# Altium project lorawan_gateway.PrjPcb (part 2 of 2)

## Sheet Power.SchDoc: Power banks
size A4; Author: Lucas Liaño; Revision: 1; SheetNumber: 7; SheetTotal: 8
Used 2 times, as channels Principal/Power, Redundado/Power. Parts and nets are listed once, with the designators drawn on the sheet.
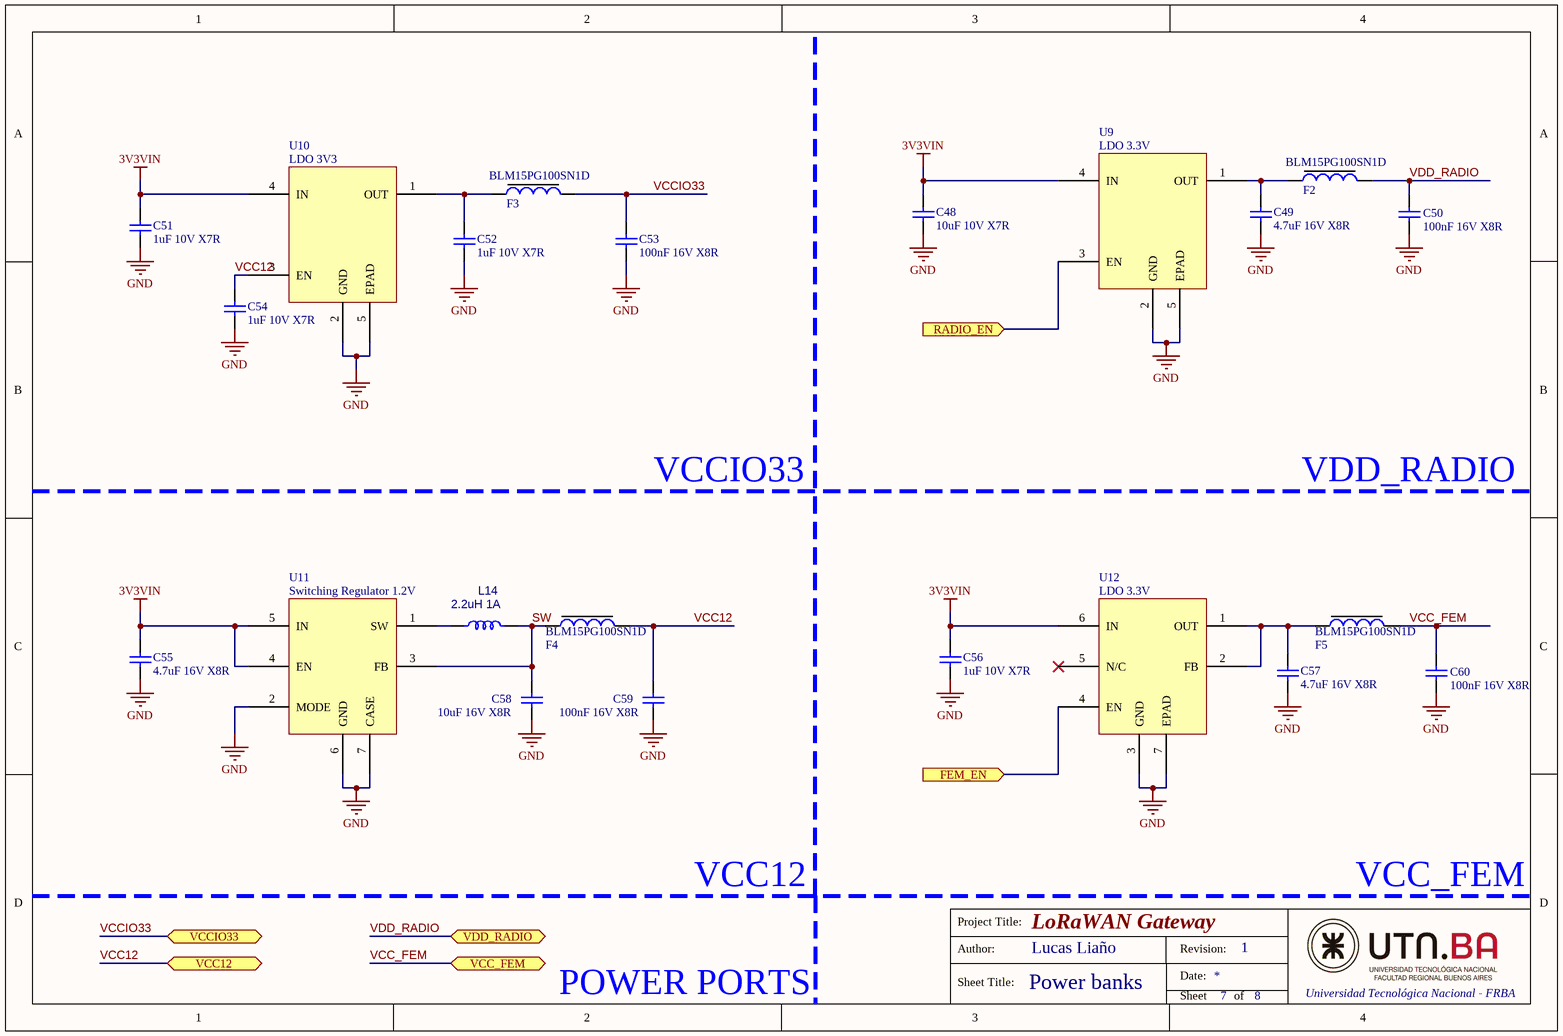
[diagram p7: Power.SchDoc]

### Parts
C48  10uF 10V X7R  [C_0603]
C49  4.7uF 16V X8R  [C_0603]
C50  100nF 16V X8R  [C_0603]
C51  1uF 10V X7R  [C_0603]
C52  1uF 10V X7R  [C_0603]
C53  100nF 16V X8R  [C_0603]
C54  1uF 10V X7R  [C_0603]
C55  4.7uF 16V X8R  [C_0603]
C56  1uF 10V X7R  [C_0603]
C57  4.7uF 16V X8R  [C_0603]
C58  10uF 16V X8R  [C_0603]
C59  100nF 16V X8R  [C_0603]
C60  100nF 16V X8R  [C_0603]
F2  BLM15PG100SN1D  [L_0402]
F3  BLM15PG100SN1D  [L_0402]
F4  BLM15PG100SN1D  [L_0402]
F5  BLM15PG100SN1D  [L_0402]
L14  2.2uH 1A  [L_1008]
U9  LDO 3.3V  [UDFN4_1x1mm]
U10  LDO 3V3  [UDFN4_1x1mm]
U11  Switching Regulator 1.2V  [WSON-6]
U12  LDO 3.3V  [XDFN6_1.2X1.2mm]

### Ports
FEM_EN (in), RADIO_EN (in), VCC12 (bidir), VCC_FEM (bidir), VCCIO33 (bidir), VDD_RADIO (bidir)

### Nets
3V3VIN: C48.1 C51.1 C55.1 C56.1 U9.4(IN) U10.4(IN) U11.4(EN) U11.5(IN) U12.6(IN)
GND: C48.2 C49.2 C50.2 C51.2 C52.2 C53.1 C54.1 C55.2 C56.2 C57.2 C58.2 C59.2 C60.2 U9.2(GND) U9.5(EPAD) U10.2(GND) U10.5(EPAD) U11.2(MODE) U11.6(GND) U11.7(CASE) U12.3(GND) U12.7(EPAD)
FEM_EN: U12.4(EN) ; port FEM_EN
RADIO_EN: U9.3(EN) ; port RADIO_EN
SW: C58.1 F4.1 L14.2 U11.3(FB)
VCC12: C54.2 C59.1 F4.2 U10.3(EN) ; port VCC12
VCC_FEM: C60.1 F5.2 ; port VCC_FEM
VCCIO33: C53.2 F3.2 ; port VCCIO33
VDD_RADIO: C50.1 F2.2 ; port VDD_RADIO
NetC49_1: C49.1 F2.1 U9.1(OUT)
NetC52_1: C52.1 F3.1 U10.1(OUT)
NetC57_1: C57.1 F5.1 U12.1(OUT) U12.2(FB)
NetL14_1: L14.1 U11.1(SW)

Not connected (* = marked no-connect by the designer): U12 5(N/C)*

### Channels
Principal/Power: designators end in A; ports FEM_EN=SX1302_CSD_Principal RADIO_EN=NetNT15A_2 VCC12=VCC12_Principal VCC_FEM=VCC_FEM_Principal VCCIO33=VCCIO33_Principal VDD_RADIO=VDD_RADIO_Principal
Redundado/Power: designators end in B; ports FEM_EN=SX1302_CSD_Redundado RADIO_EN=NetNT15B_2 VCC12=VCC12_Redundado VCC_FEM=VCC_FEM_Redundado VCCIO33=VCCIO33_Redundado VDD_RADIO=VDD_RADIO_Redundado

### Notes on the sheet
- VCCIO33
- VDD_RADIO
- VCC12
- Project Title:
- VCC_FEM
- Author:
- Sheet Title:
- Date:
- Revision:
- POWER PORTS
- Sheet
- of

### Library data of the parts
C48 = Cap: Capacitor; MPN: C2012X7R1A106K125AC; Manufacturer: TDK Corportation; Package: 0603; Price (USD): 0.3; ComponentLink2Description: SupplierLink; ComponentLink1Description: Datasheet; ComponentLink2URL: https://www.digikey.com/es/products/detail/tdk-corporation/C2012X7R1A106K125AC/2619198; ComponentLink1URL: https://www.digikey.com/es/products/detail/tdk-corporation/C2012X7R1A106K125AC/2619198; Value: 10uF 10V X7R; Supplier: Digikey
C49 C55 C57 = Cap: Capacitor; MPN: CGA5L3X8R1C475M160AB; Manufacturer: TDK Corporation; Package: 0603; Price (USD): 0.8; ComponentLink2Description: SupplierLink; ComponentLink1Description: Datasheet; Value: 4.7uF 16V X8R; Supplier: Digikey
  C49 C55: ComponentLink2URL: *; ComponentLink1URL: *
  C57: ComponentLink2URL: https://www.digikey.com/es/products/detail/tdk-corporation/CGA5L3X8R1C475M160AB/3950218; ComponentLink1URL: https://www.digikey.com/es/products/detail/tdk-corporation/CGA5L3X8R1C475M160AB/3950218
C50 C53 C59 C60 = Cap: Capacitor; MPN: C1206C104K4HACAUTO; Manufacturer: KEMET; Package: 0603; Price (USD): 0.3; ComponentLink2Description: SupplierLink; ComponentLink1Description: Datasheet; Value: 100nF 16V X8R; Supplier: Digikey
  C50 C59 C60: ComponentLink2URL: *; ComponentLink1URL: *
  C53: ComponentLink2URL: https://www.digikey.com/es/products/detail/kemet/C1206C104K4HACAUTO/7961523; ComponentLink1URL: https://www.digikey.com/es/products/detail/kemet/C1206C104K4HACAUTO/7961523
C51 C52 C54 C56 = Cap: Capacitor; MPN: C0603C105K8RAC7867; Manufacturer: KEMET; Package: 0603; Price (USD): 0.1; ComponentLink2Description: SupplierLink; ComponentLink1Description: Datasheet; Value: 1uF 10V X7R; Supplier: Digikey
  C51: ComponentLink2URL: https://www.digikey.com/es/products/detail/kemet/C0603C105K8RAC7867/2199790; ComponentLink1URL: https://www.digikey.com/es/products/detail/kemet/C0603C105K8RAC7867/2199790
  C52 C54 C56: ComponentLink2URL: *; ComponentLink1URL: *
C58 = Cap: Capacitor; MPN: CGA6P3X8R1C106M250AB; Manufacturer: TDK Corporation; Package: 0603; Price (USD): 0.8; ComponentLink2Description: SupplierLink; ComponentLink1Description: Datasheet; ComponentLink2URL: https://www.digikey.com/es/products/detail/tdk-corporation/CGA6P3X8R1C106M250AB/3950293; ComponentLink1URL: https://www.digikey.com/es/products/detail/tdk-corporation/CGA6P3X8R1C106M250AB/3950293; Value: 10uF 16V X8R; Supplier: Digikey
F2-F5 = Ferrite beads: Ferrite bead 10 ohm 1A; Manufacturer: Murata Electronics; ComponentLink1Description: Datasheet; ComponentLink2Description: SupplierLink; MPN: BLM15PG100SN1D; Package: 0402; Price (USD): 0.1; Supplier: Digikey; Value: Ferrite bead 10 ohm 1A
  F5: ComponentLink1URL: https://www.murata.com/en-us/products/productdata/8796740059166/ENFA0018.pdf; ComponentLink2URL: https://www.digikey.com/en/products/detail/murata-electronics/BLM15PG100SN1D/2587980?s=N4IgTCBcDaIEIBkCyBGArABQOIoAy4GUA5FAERAF0BfIA
L14 = IND: FIXED IND 2.2UH 1A 150 MOHM; Manufacturer: Murata Electronics; MPN: LQM2HPN2R2MJ0L; Package: 1008; Price (USD): 0.24; Value: 2.2uH 1A; ComponentLink1Description: Datasheet; ComponentLink1URL: https://search.murata.co.jp/Ceramy/image/img/P02/JELF243B-0016.pdf; ComponentLink2Description: SupplierLink; ComponentLink2URL: https://www.digikey.com/en/products/detail/murata-electronics/LQM2HPN2R2MJ0L/2594611?s=N4IgTCBcDaIDIEUCyYASAFAcmASmJAUgAxwgC6AvkA; Supplier: Digikey
U9 = NCP114: LDO IC Positive Fixed 1 Output 300mA 4-UDFN (1.0x1.0); Manufacturer: onsemi; MPN: NCP114AMX330TBG; ComponentLink1Description: Datasheet; ComponentLink1URL: https://www.onsemi.com/pdf/datasheet/ncp114-d.pdf; ComponentLink2Description: SupplierLink; ComponentLink2URL: https://www.digikey.com/en/products/detail/onsemi/NCP114AMX330TBG/6166731?s=N4IgTCBcDaIHIGEAKBGFAWAggWQBoGZ8AGAFQCEBxEAXQF8g; Package: 4UDFN; Price (USD): 0.48; Supplier: Digikey; Value: LDO 3.3V
U10 = NCP103: LDO IC Positive Fixed 1 Output 150mA 4-UDFN; Manufacturer: onsemi; MPN: NCP103AMX300TCG; Value: LDO 3V; ComponentLink1Description: Datasheet; ComponentLink1URL: https://www.onsemi.com/pdf/datasheet/ncp103-d.pdf; ComponentLink2Description: SupplierLink; ComponentLink2URL: https://www.digikey.com/en/products/detail/onsemi/NCP103AMX300TCG/5022525?s=N4IgTCBcDaIHIGEAKBGADAZgIIFkAaGaaAKggOIgC6AvkA; Package: 4-UDFN (1.0x1.0); Price (USD): 0.07; Supplier: Digikey
U11 = TPS62242DRV: Switching Regulator IC Positive Fixed 1.2V 1 Output 300mA 6-WDFN; Manufacturer: Texas Instruments; MPN: TPS62242DRVT; ComponentLink1Description: Datasheet; ComponentLink1URL: https://www.ti.com/lit/ds/symlink/tps62242.pdf?HQS=dis-dk-null-digikeymode-dsf-pf-null-wwe&ts=1656025395113; ComponentLink2Description: SupplierLink; ComponentLink2URL: https://www.digikey.com/en/products/detail/texas-instruments/TPS62242DRVT/1739884; Package: 6-WDFN Exposed Pad; Price (USD): 1.66; Supplier: Digikey; Value: Switching Regulator 1.2V
U12 = NCP176BMX330TCG: LDO IC Positive Fixed 1 Output 500mA 6-XDFN (1.2x1.2); Manufacturer: onsemi; ComponentLink1Description: Datasheet; ComponentLink1URL: https://www.onsemi.com/pdf/datasheet/ncp176-d.pdf; ComponentLink2Description: SupplierLink; ComponentLink2URL: https://www.digikey.com/en/products/detail/onsemi/NCP176BMX330TCG/5817227?s=N4IgTCBcDaIHIGEAKBGA7ANgEIFkAaAzAQAwAqCA4iALoC%2BQA; MPN: NCP176BMX330TCG; Package: 6-XDFN (1.2x1.2); Price (USD): 0.47; Supplier: Digikey; Value: LDO 3.3V

## Sheet test_connector.SchDoc: Test Connector
size A4; Author: Lucas Liaño; Revision: 1; SheetNumber: 8; SheetTotal: 8
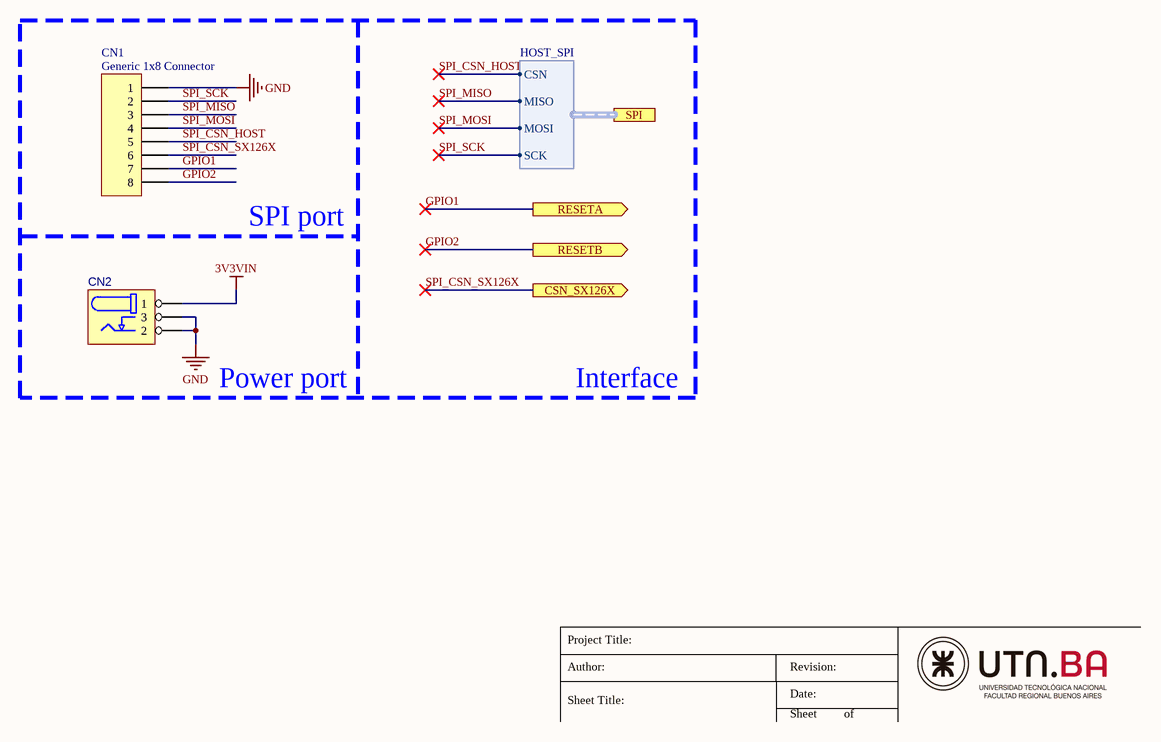
[diagram p8: test_connector.SchDoc]

### Parts
CN1  Generic 1x8 Connector  [Header_M_1x8_0.1"]
CN2  Barrel Power Connector  [PJ002B]  (value not drawn)

### Ports
CSN_SX126X (out), RESETA (out), RESETB (out), SPI (harness HOST_SPI)

### Harnesses
HOST_SPI: CSN, MISO, MOSI, SCK

### Nets
3V3VIN: CN2.1
GND: CN1.1 CN2.2 CN2.3
GPIO1: CN1.7 ; port RESETA
GPIO2: CN1.8 ; port RESETB
SPI_CSN_HOST: CN1.5 ; port SPI.CSN  [project net HOST_CSN]
SPI_CSN_SX126X: CN1.6 ; port CSN_SX126X
SPI_MISO: CN1.3 ; port SPI.MISO  [project net HOST_MISO]
SPI_MOSI: CN1.4 ; port SPI.MOSI  [project net HOST_MOSI]
SPI_SCK: CN1.2 ; port SPI.SCK  [project net HOST_SCK]

### Notes on the sheet
- SPI port
- Power port
- Interface
- Project Title:
- Author:
- Sheet Title:
- Date:
- Revision:
- Sheet
- of

### Library data of the parts
CN1 = CONN_8P: Connector Generic 8 Vias; Manufacturer: Oupiin; MPN: 2011-1X08G00SB; Value: Connector Generic 8 positions; ComponentLink1Description: Datasheet; ComponentLink1URL: https://www.digikey.com/es/products/detail/oupiin/2011-1X08G00SB/13251999; ComponentLink2Description: SupplierLink; ComponentLink2URL: https://www.digikey.com/es/products/detail/oupiin/2011-1X08G00SB/13251999; Package: Connector; Price (USD): 0.15; Supplier: Digikey
CN2 = CN_PowerJack: CONN PWR JACK 2.5X5.5MM SOLDER; Manufacturer: CUI Devices; MPN: PJ-002B; ComponentLink1Description: Datasheet; ComponentLink2Description: SupplierLink; ComponentLink2URL: https://www.digikey.com/en/products/detail/cui-devices/PJ-002B/96965; Package: Barrel jack connector; Price (USD): 0.71; Supplier: Digikey; Value: CONN PWR JACK 2.5X5.5MM SOLDER

## Nets that join several sheets
3V3VIN: Principal (NT1A.1 NT15A.1), Principal/Power (9 pins), Redundado (NT1B.1 NT15B.1), Redundado/Power (9 pins), test_connector (CN2.1)
GND: System (J1.2), Principal (10 pins), Principal/SX1302 (24 pins), Principal/RADIOA (7 pins), Principal/RADIOB (7 pins), Principal/RADIOC (9 pins), Principal/FrontEnd (24 pins), Principal/Power (22 pins), Redundado (10 pins), Redundado/SX1302 (24 pins), Redundado/RADIOA (7 pins), Redundado/RADIOB (7 pins), Redundado/RADIOC (9 pins), Redundado/FrontEnd (24 pins), Redundado/Power (22 pins), test_connector (CN1.1 CN2.2 CN2.3)
CONFIG_OK_Principal: Principal (R4A.2), Principal/SX1302 (U1A.66)
CONFIG_OK_Redundado: Redundado (R4B.2), Redundado/SX1302 (U1B.66)
GPIO1: Principal/SX1302 (D1A.2), test_connector (CN1.7)
GPIO2: Redundado/SX1302 (D1B.2), test_connector (CN1.8)
HOST_CSN: Principal/SX1302 (U1A.4), Redundado/SX1302 (U1B.4), test_connector (CN1.5)
HOST_MISO: Principal/SX1302 (R1A.2), Principal/RADIOC (R12A.1), Redundado/SX1302 (R1B.2), Redundado/RADIOC (R12B.1), test_connector (CN1.3)
HOST_MOSI: Principal/SX1302 (U1A.3), Principal/RADIOC (U4A.17), Redundado/SX1302 (U1B.3), Redundado/RADIOC (U4B.17), test_connector (CN1.4)
HOST_SCK: Principal/SX1302 (U1A.1), Principal/RADIOC (U4A.18), Redundado/SX1302 (U1B.1), Redundado/RADIOC (U4B.18), test_connector (CN1.2)
NetC20A_1: Principal (C20A.1), Principal/RADIOC (C28A.2)
NetC20B_1: Redundado (C20B.1), Redundado/RADIOC (C28B.2)
NetC41A_1: System (J1.1), Principal/FrontEnd (C41A.1 D5A.1), Redundado/FrontEnd (C41B.1 D5B.1)
NetNT15A_2: Principal (NT15A.2), Principal/Power (U9A.3)
NetNT15B_2: Redundado (NT15B.2), Redundado/Power (U9B.3)
RADIOA.RADIO_CLK_32M: Principal/SX1302 (U1A.43), Principal/RADIOA (U3A.14)
RADIOA.RADIO_CLK_32M: Redundado/SX1302 (U1B.43), Redundado/RADIOA (U3C.14)
RADIOA.RADIO_CLK_O: Principal/SX1302 (U1A.48), Principal/RADIOA (U3A.11)
RADIOA.RADIO_CLK_O: Redundado/SX1302 (U1B.48), Redundado/RADIOA (U3C.11)
RADIOA.RADIO_IQ(0): Principal/SX1302 (U1A.44), Principal/RADIOA (U3A.13)
RADIOA.RADIO_IQ(0): Redundado/SX1302 (U1B.44), Redundado/RADIOA (U3C.13)
RADIOA.RADIO_IQ(1): Principal/SX1302 (U1A.45), Principal/RADIOA (U3A.12)
RADIOA.RADIO_IQ(1): Redundado/SX1302 (U1B.45), Redundado/RADIOA (U3C.12)
RADIOA.RADIO_IQ(2): Principal/SX1302 (U1A.49), Principal/RADIOA (U3A.5)
RADIOA.RADIO_IQ(2): Redundado/SX1302 (U1B.49), Redundado/RADIOA (U3C.5)
RADIOA.RADIO_IQ(3): Principal/SX1302 (U1A.41), Principal/RADIOA (U3A.21)
RADIOA.RADIO_IQ(3): Redundado/SX1302 (U1B.41), Redundado/RADIOA (U3C.21)
RADIOA.SPI_CSN: Principal/SX1302 (U1A.68), Principal/RADIOA (U3A.19)
RADIOA.SPI_CSN: Redundado/SX1302 (U1B.68), Redundado/RADIOA (U3C.19)
RADIOA.SPI_MISO: Principal/SX1302 (U1A.42), Principal/RADIOA (U3A.16)
RADIOA.SPI_MISO: Redundado/SX1302 (U1B.42), Redundado/RADIOA (U3C.16)
RADIOA.SPI_MOSI: Principal/SX1302 (U1A.67), Principal/RADIOA (U3A.17)
RADIOA.SPI_MOSI: Redundado/SX1302 (U1B.67), Redundado/RADIOA (U3C.17)
RADIOA.SPI_SCK: Principal/SX1302 (U1A.65), Principal/RADIOA (U3A.18)
RADIOA.SPI_SCK: Redundado/SX1302 (U1B.65), Redundado/RADIOA (U3C.18)
RADIOA_NRESET_Principal: Principal/SX1302 (U1A.31), Principal/RADIOA (U3A.15)
RADIOA_NRESET_Redundado: Redundado/SX1302 (U1B.31), Redundado/RADIOA (U3C.15)
RADIOB.RADIO_CLK_32M: Principal/SX1302 (U1A.34), Principal/RADIOB (U3B.14)
RADIOB.RADIO_CLK_32M: Redundado/SX1302 (U1B.34), Redundado/RADIOB (U3D.14)
RADIOB.RADIO_CLK_O: Principal/SX1302 (U1A.37), Principal/RADIOB (U3B.11)
RADIOB.RADIO_CLK_O: Redundado/SX1302 (U1B.37), Redundado/RADIOB (U3D.11)
RADIOB.RADIO_IQ(0): Principal/SX1302 (U1A.35), Principal/RADIOB (U3B.13)
RADIOB.RADIO_IQ(0): Redundado/SX1302 (U1B.35), Redundado/RADIOB (U3D.13)
RADIOB.RADIO_IQ(1): Principal/SX1302 (U1A.36), Principal/RADIOB (U3B.12)
RADIOB.RADIO_IQ(1): Redundado/SX1302 (U1B.36), Redundado/RADIOB (U3D.12)
RADIOB.RADIO_IQ(2): Principal/SX1302 (U1A.38), Principal/RADIOB (U3B.5)
RADIOB.RADIO_IQ(2): Redundado/SX1302 (U1B.38), Redundado/RADIOB (U3D.5)
RADIOB.RADIO_IQ(3): Principal/SX1302 (U1A.32), Principal/RADIOB (U3B.21)
RADIOB.RADIO_IQ(3): Redundado/SX1302 (U1B.32), Redundado/RADIOB (U3D.21)
RADIOB.SPI_CSN: Principal/SX1302 (U1A.18), Principal/RADIOB (U3B.19)
RADIOB.SPI_CSN: Redundado/SX1302 (U1B.18), Redundado/RADIOB (U3D.19)
RADIOB.SPI_MISO: Principal/SX1302 (U1A.33), Principal/RADIOB (U3B.16)
RADIOB.SPI_MISO: Redundado/SX1302 (U1B.33), Redundado/RADIOB (U3D.16)
RADIOB.SPI_MOSI: Principal/SX1302 (U1A.19), Principal/RADIOB (U3B.17)
RADIOB.SPI_MOSI: Redundado/SX1302 (U1B.19), Redundado/RADIOB (U3D.17)
RADIOB.SPI_SCK: Principal/SX1302 (U1A.21), Principal/RADIOB (U3B.18)
RADIOB.SPI_SCK: Redundado/SX1302 (U1B.21), Redundado/RADIOB (U3D.18)
RADIOB_NRESET_Principal: Principal/SX1302 (U1A.26), Principal/RADIOB (U3B.15)
RADIOB_NRESET_Redundado: Redundado/SX1302 (U1B.26), Redundado/RADIOB (U3D.15)
RFO_RADIOA_Principal: Principal (L1A.2 L2A.1), Principal/RADIOA (U3A.24)
RFO_RADIOA_Redundado: Redundado (L1B.2 L2B.1), Redundado/RADIOA (U3C.24)
RX_ON_Principal: Principal (R6A.2), Principal/SX1302 (U1A.59)
RX_ON_Redundado: Redundado (R6B.2), Redundado/SX1302 (U1B.59)
SPI_CSN_SX126X: Principal/RADIOC (U4A.19), Redundado/RADIOC (U4B.19), test_connector (CN1.6)
SX126x_NRESET: Principal (NT1A.2), Principal/RADIOC (U4A.15)
SX126x_NRESET: Redundado (NT1B.2), Redundado/RADIOC (U4B.15)
SX1262_DIO1_Principal: Principal/SX1302 (U1A.54), Principal/RADIOC (U4A.13)
SX1262_DIO1_Redundado: Redundado/SX1302 (U1B.54), Redundado/RADIOC (U4B.13)
SX1302_CSD_Principal: Principal (R7A.1), Principal/SX1302 (U1A.10), Principal/FrontEnd (R13A.2), Principal/Power (U12A.4)
SX1302_CSD_Redundado: Redundado (R7B.1), Redundado/SX1302 (U1B.10), Redundado/FrontEnd (R13B.2), Redundado/Power (U12B.4)
SX1302_PA_ON_Principal: Principal/SX1302 (U1A.12), Principal/FrontEnd (R15A.2)
SX1302_PA_ON_Redundado: Redundado/SX1302 (U1B.12), Redundado/FrontEnd (R15B.2)
SX1302_RXTX_SW_Principal: Principal/SX1302 (U1A.29), Principal/FrontEnd (R14A.2)
SX1302_RXTX_SW_Redundado: Redundado/SX1302 (U1B.29), Redundado/FrontEnd (R14B.2)
SYS_RFI_Principal: Principal (C20A.2), Principal/RADIOA (C22A.2), Principal/RADIOB (C22B.2), Principal/FrontEnd (U7A.1)
SYS_RFI_Redundado: Redundado (C20B.2), Redundado/RADIOA (C22C.2), Redundado/RADIOB (C22D.2), Redundado/FrontEnd (U7B.1)
SYS_RFO_Principal: Principal (C19A.1 L3A.2), Principal/FrontEnd (U5A.1)
SYS_RFO_Redundado: Redundado (C19B.1 L3B.2), Redundado/FrontEnd (U5B.1)
TCXO_32M_Principal: Principal (U2A.3), Principal/RADIOA (R10A.1), Principal/RADIOB (R10B.1), Principal/RADIOC (R11A.1)
TCXO_32M_Redundado: Redundado (U2B.3), Redundado/RADIOA (R10C.1), Redundado/RADIOB (R10D.1), Redundado/RADIOC (R11B.1)
TX_ON_Principal: Principal (R5A.2), Principal/SX1302 (U1A.63)
TX_ON_Redundado: Redundado (R5B.2), Redundado/SX1302 (U1B.63)
VCC12_Principal: Principal/SX1302 (10 pins), Principal/Power (C54A.2 C59A.1 F4A.2 U10A.3)
VCC12_Redundado: Redundado/SX1302 (10 pins), Redundado/Power (C54B.2 C59B.1 F4B.2 U10B.3)
VCC_FEM_Principal: Principal/FrontEnd (8 pins), Principal/Power (C60A.1 F5A.2)
VCC_FEM_Redundado: Redundado/FrontEnd (8 pins), Redundado/Power (C60B.1 F5B.2)
VCCIO33_Principal: Principal (R7A.2), Principal/SX1302 (11 pins), Principal/Power (C53A.2 F3A.2)
VCCIO33_Redundado: Redundado (R7B.2), Redundado/SX1302 (11 pins), Redundado/Power (C53B.2 F3B.2)
VDD_RADIO_Principal: Principal (NT13A.2), Principal/RADIOA (NT16A.2), Principal/RADIOB (NT16B.2), Principal/RADIOC (NT17A.2), Principal/Power (C50A.1 F2A.2)
VDD_RADIO_Redundado: Redundado (NT13B.2), Redundado/RADIOA (NT16C.2), Redundado/RADIOB (NT16D.2), Redundado/RADIOC (NT17B.2), Redundado/Power (C50B.1 F2B.2)
VR_PA: Principal (C15A.1 C16A.1 L1A.1), Principal/RADIOA (U3A.1)
VR_PA: Redundado (C15B.1 C16B.1 L1B.1), Redundado/RADIOA (U3C.1)